# Altium schematic sheet 04-lnterface1.SchDoc
size A3; SheetNumber: 2; SheetTotal: 5
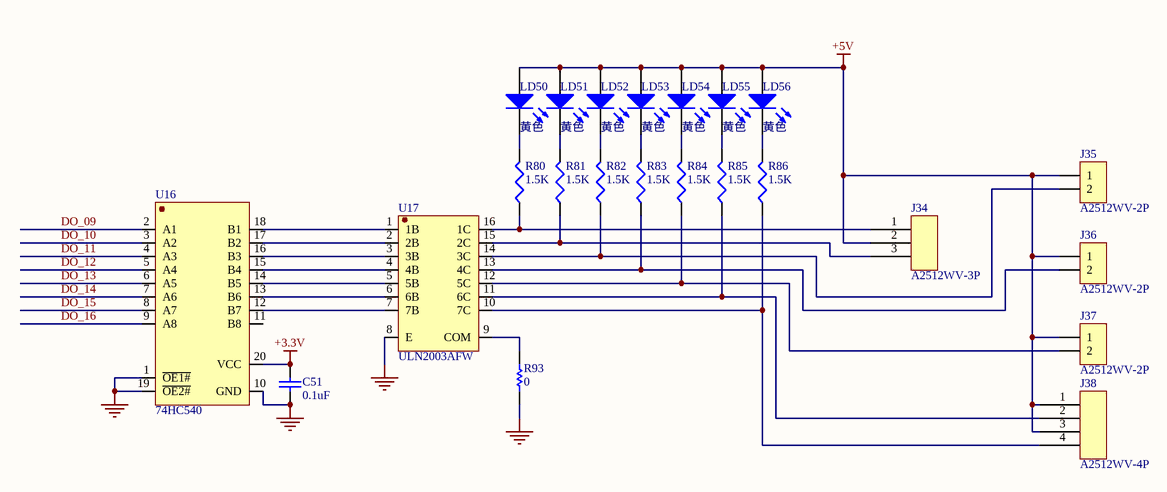
[diagram p0: 04-lnterface1.SchDoc]

## Parts
C51  value 0.1uF  [C0805]  (hidden comment: Cap)
J34  A2512WV-3P  [A2512WV-3P]
J35  A2512WV-2P  [A2512WV-2P]
J36  A2512WV-2P  [A2512WV-2P]
J37  A2512WV-2P  [A2512WV-2P]
J38  A2512WV-4P  [A2512WV-4P]
LD50  黄色  [LED0805]
LD51  黄色  [LED0805]
LD52  黄色  [LED0805]
LD53  黄色  [LED0805]
LD54  黄色  [LED0805]
LD55  黄色  [LED0805]
LD56  黄色  [LED0805]
R80  value 1.5K  [R0805]  (hidden comment: Res3)
R81  value 1.5K  [R0805]  (hidden comment: Res3)
R82  value 1.5K  [R0805]  (hidden comment: Res3)
R83  value 1.5K  [R0805]  (hidden comment: Res3)
R84  value 1.5K  [R0805]  (hidden comment: Res3)
R85  value 1.5K  [R0805]  (hidden comment: Res3)
R86  value 1.5K  [R0805]  (hidden comment: Res3)
R93  0  [R0805]
U16  74HC540  [SOP-20]
U17  ULN2003AFW  [SO-16P]

## Nets
+3.3V: C51.2 U16.20(VCC)
+5V: J34.2 J35.1 J36.1 J37.1 J38.1 J38.3 LD50.1(A) LD51.1(A) LD52.1(A) LD53.1(A) LD54.1(A) LD55.1(A) LD56.1(A)
GND: C51.1 R93.1 U16.1(~{OE1#}) U16.10(GND) U16.19(~{OE2#}) U17.8(E)
DO_09: U16.2(A1)
DO_10: U16.3(A2)
DO_11: U16.4(A3)
DO_12: U16.5(A4)
DO_13: U16.6(A5)
DO_14: U16.7(A6)
DO_15: U16.8(A7)
DO_16: U16.9(A8)
NetJ34_1: J34.1 R80.1 U17.16(1C)
NetJ34_3: J34.3 R81.1 U17.15(2C)
NetJ35_2: J35.2 R82.1 U17.14(3C)
NetJ36_2: J36.2 R83.1 U17.13(4C)
NetJ37_2: J37.2 R84.1 U17.12(5C)
NetJ38_2: J38.2 R85.1 U17.11(6C)
NetJ38_4: J38.4 R86.1 U17.10(7C)
NetLD50_2: LD50.2(K) R80.2
NetLD51_2: LD51.2(K) R81.2
NetLD52_2: LD52.2(K) R82.2
NetLD53_2: LD53.2(K) R83.2
NetLD54_2: LD54.2(K) R84.2
NetLD55_2: LD55.2(K) R85.2
NetLD56_2: LD56.2(K) R86.2
NetR93_2: R93.2 U17.9(COM)
NetU16_12: U16.12(B7) U17.7(7B)
NetU16_13: U16.13(B6) U17.6(6B)
NetU16_14: U16.14(B5) U17.5(5B)
NetU16_15: U16.15(B4) U17.4(4B)
NetU16_16: U16.16(B3) U17.3(3B)
NetU16_17: U16.17(B2) U17.2(2B)
NetU16_18: U16.18(B1) U17.1(1B)

Not connected (* = marked no-connect by the designer): U16 11(B8)

## Library data of the parts
C51 = Cap: Capacitor; Published: 8-Jun-2000; LatestRevisionDate: 17-Jul-2002; LatestRevisionNote: Re-released for DXP Platform.; Publisher: Altium Limited
LD50-LD56 = LED0: Typical INFRARED GaAs LED; Published: 8-Jun-2000; LatestRevisionDate: 17-Jul-2002; LatestRevisionNote: Re-released for DXP Platform.; Publisher: Altium Limited
R80-R86 = Res3: Resistor; Published: 8-Jun-2000; LatestRevisionDate: 17-Jul-2002; LatestRevisionNote: Re-released for DXP Platform.; Publisher: Altium Limited
R93 = R 1206: ComponentLink1Description: New link; ComponentLink1URL: *; Parameter 1: 0